# Altium project Elreg_Sender_2021.PrjPcb (part 1 of 2)
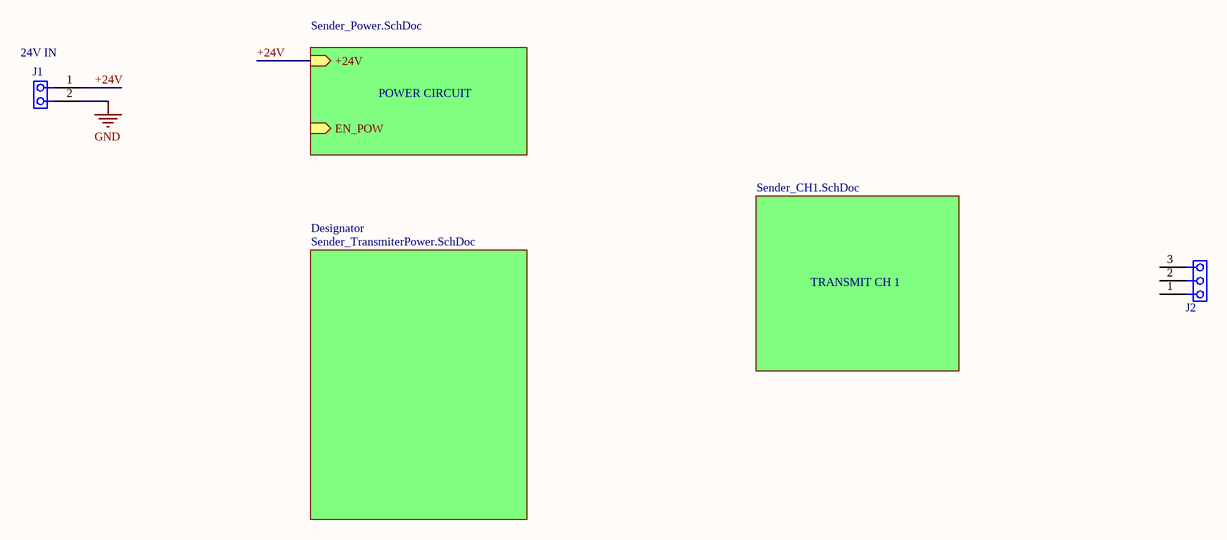
[diagram p0: Sender_Top.SchDoc]
4 sheets, 139 parts. Net scope: hierarchical (ports join the sheet entries above them; power ports are global).
Board file: Elreg_Sender_NoFPGA.PcbDoc
Sheets:
  Sender_Top.SchDoc
    POWER CIRCUIT = Sender_Power.SchDoc
    TRANSMIT CH 1 = Sender_CH1.SchDoc
    Designator = Sender_TransmiterPower.SchDoc

## Sheet Sender_Top.SchDoc
size A4

### Parts
J1  24V IN  [WAGO_2_pins]
J2  CONN 3x1  [WAGO-3_pins]  (value not drawn)

### Sub-sheets
Designator = Sender_TransmiterPower.SchDoc: no entries
POWER CIRCUIT = Sender_Power.SchDoc: +24V (in), EN_POW (in)
TRANSMIT CH 1 = Sender_CH1.SchDoc: no entries

### Nets
GND: J1.2(Vout)
+24V: J1.1(Vout) ; sheet POWER CIRCUIT/+24V

Not connected (* = marked no-connect by the designer): J2 1(Vout) 2(Vout) 3(Vout)

### Library data of the parts
J1 = 2x1 connector
J2 = 3x1 connector

## Sheet Sender_Power.SchDoc
size A4
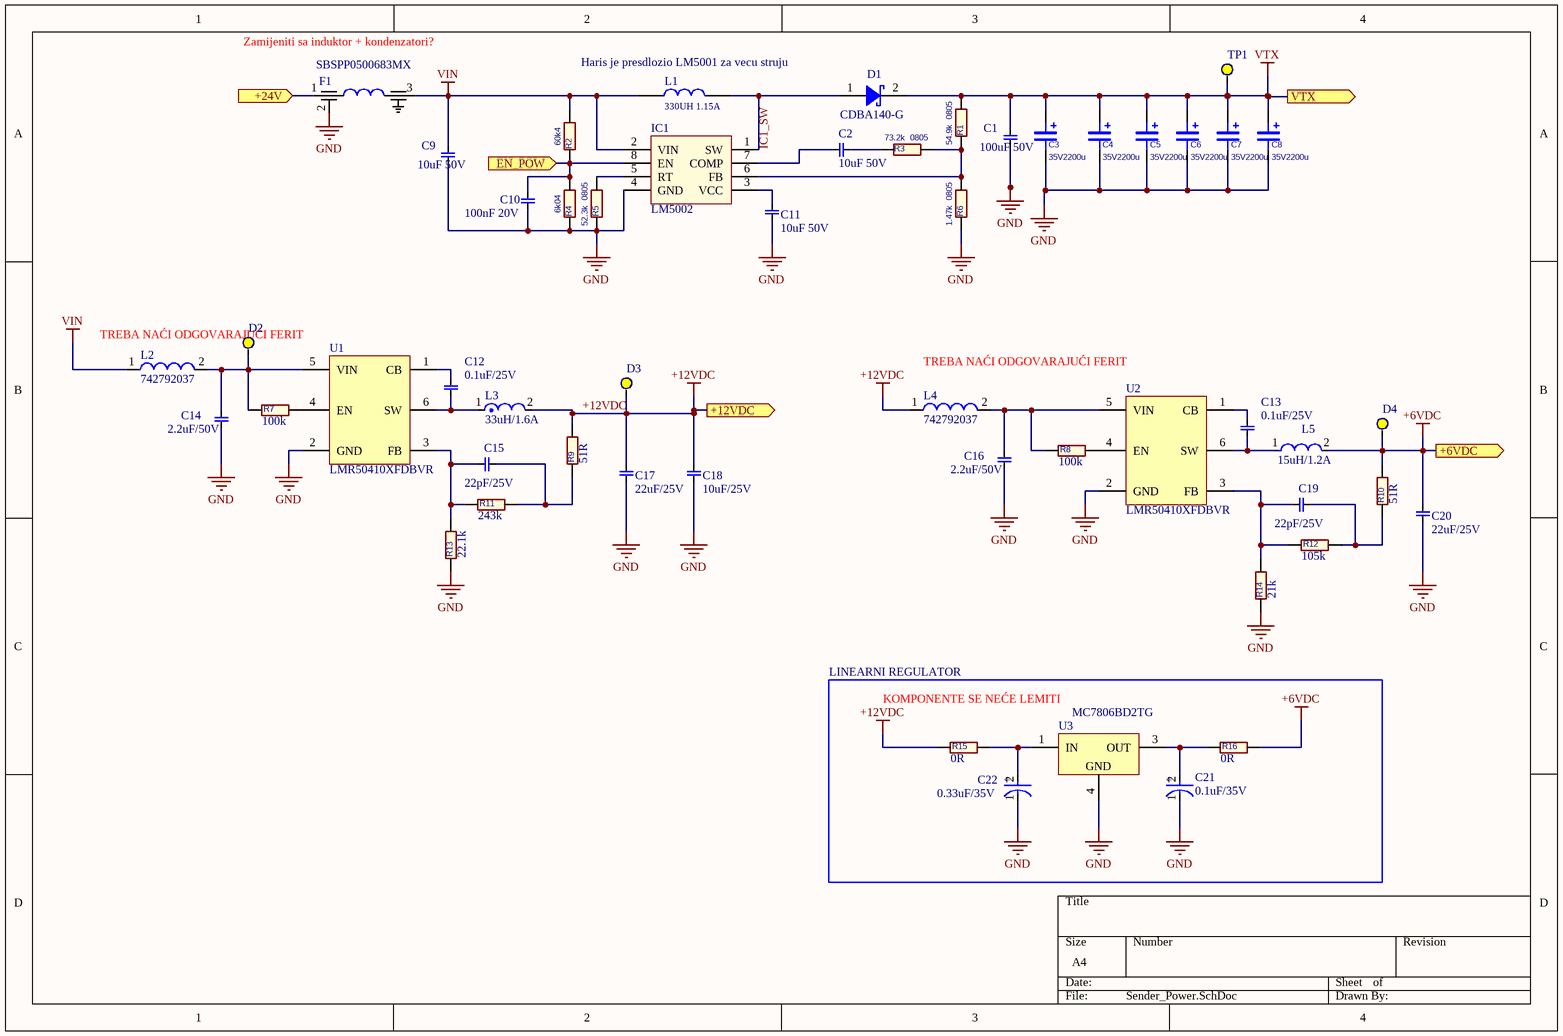
[diagram p1: Sender_Power.SchDoc]

### Parts
C1  100uF 50V  [C-0805]
C2  10uF 50V  [C-0603]
C3  35V2200u  [CAP_16X25]
C4  35V2200u  [CAP_16X25]
C5  35V2200u  [CAP_16X25]
C6  35V2200u  [CAP_16X25]
C7  35V2200u  [CAP_16X25]
C8  35V2200u  [CAP_16X25]
C9  10uF 50V  [C-0805]
C10  100nF 20V  [C-0603]
C11  10uF 50V  [C-0603]
C12  0.1uF/25V  [C-0603]
C13  0.1uF/25V  [C-0603]
C14  2.2uF/50V  [FP-CL31-IPC_B]
C15  22pF/25V  [C-0603]
C16  2.2uF/50V  [FP-CL31-IPC_B]
C17  22uF/25V  [CAP-1210]
C18  10uF/25V  [C-1206 (3216 metric)]
C19  22pF/25V  [C-0603]
C20  22uF/25V  [CAP-1210]
C21  0.1uF/35V  [FP-UUP1H0R1MCL1GS-MFG]
C22  0.33uF/35V  [FP-UUP1H0R1MCL1GS-MFG]
D1  Manufacturer Part Number 1: CDBA140-G  [DFN380P520X45-2N]  (hidden comment: DIODE SCHOTTKY 40V 1A DO214AC)
D2  Test_Point  [Test_Point]  (value not drawn)
D3  Test_Point  [Test_Point]  (value not drawn)
D4  Test_Point  [Test_Point]  (value not drawn)
F1  SBSPP0500683MX  [Filter_SBSPP0500]
IC1  LM5002  [SOIC127P600X205-8N]
L1  330UH 1.15A  [IND]
L2  742792037  [SMD-0805]
L3  33uH/1.6A  [FP-DS104C2-MFG]
L4  742792037  [SMD-0805]
L5  15uH/1.2A  [FP-LQH5BPB_T0-MFG]
R1  54.9k  0805  [R-0603]
R2  60k4  [R-0603]
R3  73.2k  0805  [R-0603]
R4  6k04  [R-0603]
R5  52.3k  0805  [R-0603]
R6  1.47k  0805  [R-0603]
R7  100k  [R-0603]
R8  100k  [R-0603]
R9  51R  [R-0603]
R10  51R  [R-0603]
R11  243k  [R-0603]
R12  105k  [R-0603]
R13  22.1k  [R-0603]
R14  21k  [R-0603]
R15  0R  [RES-0805]
R16  0R  [RES-0805]
TP1  Test_Point  [Test_Point]  (value not drawn)
U1  LMR50410XFDBVR  [SOT-23]
U2  LMR50410XFDBVR  [SOT-23]
U3  MC7806BD2TG  [D2PAK]

### Ports
+6VDC (out), +12VDC (out), +24V (in), EN_POW (in), VTX (out)

### Nets
+6VDC: C20.2(G) D4.1 L5.2 R10.2 R16.2 ; port +6VDC
+12VDC: C17.2(G) C18.1(G) D3.1 L3.2 L4.1 R9.2 R15.1 ; port +12VDC
GND: C1.2(G) C3.2 C4.2 C5.2 C6.2 C7.2 C8.2 C9.2(G) C10.1(G) C11.2(G) C14.1(G) C16.1(G) C17.1(G) C18.2(G) C20.1(G) C21.1(C) C22.1(C) F1.2 IC1.4(GND) R4.1 R5.1 R6.1 R13.1 R14.1 U1.2(GND) U2.2(GND) U3.4(GND)
VIN: C9.1(G) F1.3 IC1.2(VIN) L1.1(A) L2.1 R2.2
VTX: C1.1(G) C3.1 C4.1 C5.1 C6.1 C7.1 C8.1 D1.2(A) R1.2 TP1.1 ; port VTX
+24V: F1.1 ; port +24V
NetC2_1: C2.1(G) IC1.7(COMP)
NetC2_2: C2.2(G) R3.1
NetC10_2: C10.2(G) IC1.8(EN) R2.1 R4.2 ; port EN_POW
NetC11_1: C11.1(G) IC1.3(VCC)
NetC12_1: C12.1(G) L3.1 U1.6(SW)
NetC12_2: C12.2(G) U1.1(CB)
NetC13_1: C13.1(G) L5.1 U2.6(SW)
NetC13_2: C13.2(G) U2.1(CB)
NetC14_2: C14.2(G) D2.1 L2.2 R7.1 U1.5(VIN)
NetC15_1: C15.1(G) R11.1 R13.2 U1.3(FB)
NetC15_2: C15.2(G) R9.1 R11.2
NetC16_2: C16.2(G) L4.2 R8.1 U2.5(VIN)
NetC19_1: C19.1(G) R12.1 R14.2 U2.3(FB)
NetC19_2: C19.2(G) R10.1 R12.2
NetC21_2: C21.2(A) R16.1 U3.3(OUT)
NetC22_2: C22.2(A) R15.2 U3.1(IN)
NetD1_1: D1.1(A) IC1.1(SW) L1.2(A)
NetIC1_5: IC1.5(RT) R5.2
NetIC1_6: IC1.6(FB) R1.1 R3.2 R6.2
NetR7_2: R7.2 U1.4(EN)
NetR8_2: R8.2 U2.4(EN)

### Notes on the sheet
- (near F1) Zamijeniti sa induktor + kondenzatori?
- (near L1) Haris je presdlozio LM5001 za vecu struju
- (near D2) TREBA NAĆI ODGOVARAJUĆI FERIT
- TREBA NAĆI ODGOVARAJUĆI FERIT
- LINEARNI REGULATOR
- KOMPONENTE SE NEĆE LEMITI
- Labels drawn without touching a wire or pin: IC1_SW
- (in symbol UUP1H0R1MCL1GS) +
- (in symbol UZS1HR33MCL1GB) +

### Library data of the parts
C1 C2 C9 C11 = C-0805_10uF: Manufacturer 1: Yageo; Manufacturer Part Number 1: CC1206KKX7RBBB332; Tolerance: ±10%; Voltage - Rated: 500V; Temperature Coefficient: X7R; Notification: Current market demand for these product types have resulted in fluctuating and extending lead times. Lead times may differ.; Description 1: CAP CER 3300PF 500V X7R 1206; Category 1: Capacitors; Packaging: Cut Tape (CT); Part Status: Active; Operating Temperature: -55°C ~ 125°C; Features: -; Ratings: -; Applications: General Purpose; Failure Rate: -; Mounting Type: Surface Mount, MLCC; Package / Case: 1206 (3216 Metric); Size / Dimension: 0.126" L x 0.063" W (3.20mm x 1.60mm); Height - Seated (Max): -; Thickness (Max): 0.057" (1.45mm); Lead Spacing: -; Lead Style: -; ComponentLink1URL: http://www.yageo.com/documents/recent/UPY-NP0X7R_MV_100-to-630V_21.pdf; ComponentLink1Description: http://www.yageo.com/documents/recent/UPY-NP0X7R_MV_100-to-630V_21.pdf; Supplier 1: Digi-Key; Supplier Part Number 1: 311-1506-1-ND; RoHS 1: RoHS Compliant; Stock 1: 4928; Pricing 1: 1=0.31, 10=0.214, 100=0.1085, 500=0.07424, 1000=0.06568 (USD)
C3-C8 = CAP_2200uF_35V: Capacitor; Manufacturer: Kemet; Manufacturer Part Number: ESH228M035AM7AA; Capacitance: 2200µF; Tolerance: ±20%; Voltage Rating: 35V; Lifetime @ Temp.: 2000 Hrs @ 105°C; Supplier 1: Digi-Key; Supplier Part Number 1: 399-6572-ND; RoHS: RoHS Compliant; Category: Capacitors; Stock 1: 1972; Pricing 1: 1=0.98, 10=0.77, 50=0.6676, 100=0.5778, 250=0.5136, 500=0.43656, 1000=0.3852, 2500=0.35952, 5000=0.34668 (USD); Packaging: Bulk; ESR (Equivalent Series Resistance): -; Operating Temperature: -40°C ~ 105°C; Type: -; Applications: General Purpose; Ripple Current: -; Impedance: -; Lead Spacing: 0.295" (7.50mm); Size / Dimension: 0.630" Dia (16.00mm); Height - Seated (Max): 1.063" (27.00mm); Surface Mount Land Size: -; Mounting Type: Through Hole; Package / Case: Radial, Can; ComponentLink1URL: http://www.kemet.com/docfinder?Partnumber=ESH228M035AM7AA; ComponentLink1Description: http://www.kemet.com/docfinder?Partnumber=ESH228M035AM7AA
C10 = C-0805_100nF: Manufacturer 1: Yageo; Manufacturer Part Number 1: CC1206KKX7RBBB332; Tolerance: ±10%; Voltage - Rated: 500V; Temperature Coefficient: X7R; Notification: Current market demand for these product types have resulted in fluctuating and extending lead times. Lead times may differ.; Description 1: CAP CER 3300PF 500V X7R 1206; Category 1: Capacitors; Packaging: Cut Tape (CT); Part Status: Active; Operating Temperature: -55°C ~ 125°C; Features: -; Ratings: -; Applications: General Purpose; Failure Rate: -; Mounting Type: Surface Mount, MLCC; Package / Case: 1206 (3216 Metric); Size / Dimension: 0.126" L x 0.063" W (3.20mm x 1.60mm); Height - Seated (Max): -; Thickness (Max): 0.057" (1.45mm); Lead Spacing: -; Lead Style: -; ComponentLink1URL: http://www.yageo.com/documents/recent/UPY-NP0X7R_MV_100-to-630V_21.pdf; ComponentLink1Description: http://www.yageo.com/documents/recent/UPY-NP0X7R_MV_100-to-630V_21.pdf; Supplier 1: Digi-Key; Supplier Part Number 1: 311-1506-1-ND; RoHS 1: RoHS Compliant; Stock 1: 4928; Pricing 1: 1=0.31, 10=0.214, 100=0.1085, 500=0.07424, 1000=0.06568 (USD)
C12 C13 = 06033C104JAZ2A: 0.1µF ±5% 25V Ceramic Capacitor X7R 0603 (1608 Metric); Manufacturer: Kyocera AVX; Capacitance: 100nF; ComponentLink1URL: http://catalogs.avx.com/SurfaceMount.pdf?src-supplier=Digi-Key; ComponentLink1Description: http://catalogs.avx.com/SurfaceMount.pdf?src-supplier=Digi-Key; Case/Package: 0603; Category: Ceramic Capacitors; Dielectric: X7R; Features: Soft Termination; Length: 0.063inch; Manufacturer Part Number: 06033C104JAZ2A; Max Operating Temperature: 125°C; Min Operating Temperature: -55°C; Mount: Surface Mount; Package Quantity: 4000; Packaging: Tape and Reel; RoHS Compliant: Yes; Thickness: 0.035inch; Tolerance: 5%; Voltage Rating: 25V; Voltage Rating (DC): 25V; Width: 0.031inch
C14 C16 = CL31B225KBHVPNE: Cap Ceramic 2.2uF 50V X7R ±10% SMD 1206 +125°C Embossed T/R; Width: 0.063inch; Case/Package: 1206; Tolerance: 10%; Mount: Surface Mount; Capacitance: 2.2uF; Ratings: AEC-Q200; Thickness: 0.071inch; Voltage Rating: 50V; Features: Soft Termination; Case Code (Metric): 3216; Length: 0.126inch; Packaging: Tape and Reel; Max Operating Temperature: 125°C; Min Operating Temperature: -55°C; Case Code (Imperial): 1206; Dielectric: X7R
C15 C19 = C0603C220K3GACTU: 22pF ±10% 25V Ceramic Capacitor C0G, NP0 0603 (1608 Metric); Manufacturer: KEMET; Dissipation Factor: 0.1%; Width: 0.031inch; Capacitance: 22pF; Case Code (Imperial): 0603; Case Code (Metric): 1608; Case/Package: 0603; Category: Ceramic Capacitors; Construction: Flat; Contact Plating: Tin,Matte; Depth: 0.8mm; Dielectric: C0G; Dielectric Material: Ceramic; Height: 0.8mm; Lead Free: Lead Free; Lead Pitch: 0.7mm; Length: 1.6mm; Manufacturer Part Number: C0603C220K3GACTU; Max Operating Temperature: 125°C; Min Operating Temperature: -55°C; Mount: Surface Mount; Package Quantity: 4000; Packaging: Tape and Reel; Radiation Hardening: No; RoHS Compliant: Yes; Series: C; Termination: SMD/SMT; Thickness: 0.034inch; Tolerance: 10%; Voltage Rating: 25V; Voltage Rating (DC): 25V; ComponentLink1URL: https://datasheet.ciiva.com/5413/kem-c1003-c0g-smd-356956-5413159.pdf?src-supplier=Mouser; ComponentLink1Description: https://datasheet.ciiva.com/5413/kem-c1003-c0g-smd-356956-5413159.pdf?src-supplier=Mouser
C17 C20 = CL32B226KAJNNNE: 22µF ±10% 25V Ceramic Capacitor X7R 1210 (3225 Metric); Manufacturer: Samsung; Capacitance: 22uF; Case Code (Imperial): 1210; Case Code (Metric): 3225; Case/Package: 1210; Category: Ceramic Capacitors; Construction: Flat; Depth: 2.5mm; Dielectric: X7R; Height: 2.5mm; Lead Free: Lead Free; Length: 3.2mm; Manufacturer Part Number: CL32B226KAJNNNE; Material: Ceramic; Max Operating Temperature: 125°C; Min Operating Temperature: -55°C; Mount: Surface Mount; Package Quantity: 1; Packaging: Tape and Reel; Radiation Hardening: No; RoHS Compliant: Yes; Series: CL; Thickness: 0.106inch; Tolerance: 10%; Voltage Rating: 25V; Voltage Rating (DC): 25V; Width: 0.098inch
C18 = CL31B106KAHNNNE: 10µF ±10% 25V Ceramic Capacitor X7R 1206 (3216 Metric); Manufacturer: Samsung; Capacitance: 10uF; Case Code (Imperial): 1206; Case Code (Metric): 3216; Case/Package: 1206; Category: Ceramic Capacitors; Construction: Flat; Depth: 1.6mm; Dielectric: X7R; Height: 1.6mm; Length: 3.2mm; Manufacturer Part Number: CL31B106KAHNNNE; Max Operating Temperature: 125°C; Min Operating Temperature: -55°C; Mount: Surface Mount; Package Quantity: 1; Packaging: Tape and Reel; Radiation Hardening: No; RoHS Compliant: Yes; Series: CL; Thickness: 0.071inch; Tolerance: 10%; Voltage: 25V; Voltage Rating: 25V; Width: 0.063inch; ComponentLink1URL: https://datasheet.ciiva.com/25795/cl31b106kahnnne-25795260.pdf?src-supplier=Digi-Key; ComponentLink1Description: https://datasheet.ciiva.com/25795/cl31b106kahnnne-25795260.pdf?src-supplier=Digi-Key
C21 = UUP1H0R1MCL1GS: 0.1µF 50V Aluminum Electrolytic Capacitors Radial, Can - SMD  1000 Hrs @ 105°C; Life (Hours): 1000Hour; Leakage Current: 10uA; Ripple Current: 1mA; Tolerance: 20%; Dissipation Factor: 0.15%; Capacitance: 100nF; Radiation Hardening: No; Max Operating Temperature: 105°C; Voltage Rating: 50V; Package Quantity: 2000; Diameter: 4mm; Voltage Rating (DC): 50V; Mount: Surface Mount; Packaging: Tape and Reel; Termination: SMD/SMT; Min Operating Temperature: 1000°C; Length: 5.8mm; Height: 5.8mm; Case/Package: Radial; Height - Seated (Max): 0.157inch
C22 = UZS1HR33MCL1GB: 0.33µF 50V Aluminum Electrolytic Capacitors Radial, Can - SMD  2000 Hrs @ 85°C; Manufacturer: Nichicon; Capacitance: 330nF; Leakage Current: 3uA; Life (Hours): 2000Hour; Ripple Current: 2.8mA; Tolerance: 20%; Voltage Rating (DC): 50V; Case/Package: Radial; Category: Aluminum Electrolytic Capacitors; Features: General Purpose; Height - Seated (Max): 0.157inch; Length: 4.5mm; Manufacturer Part Number: UZS1HR33MCL1GB; Max Operating Temperature: 85°C; Min Operating Temperature: -40°C; Mount: Surface Mount; Package Quantity: 2000; Packaging: Tape and Reel; RoHS Compliant: Yes; Series: ZS; Termination: SMD/SMT; Voltage Rating: 50V
D1 = DIODE SCHOTTKY 40V 1A DO214AC: Manufacturer 1: Comchip Technology; Category 1: Discrete Semiconductor Products; Speed: Fast Recovery =< 500ns, > 200mA (Io); Supplier 1: Digi-Key; Supplier Part Number 1: 641-1015-1-ND; RoHS 1: RoHS Compliant; Description 1: DIODE SCHOTTKY 40V 1A DO214AC; Stock 1: 527910; Pricing 1: 1=0.37, 10=0.338, 100=0.1893, 500=0.1014, 1000=0.06895 (USD); Packaging: Cut Tape (CT); Part Status: Active; Diode Type: Schottky; Current - Average Rectified (Io): 1A; Capacitance @ Vr, F: -; Mounting Type: Surface Mount; Package / Case: DO-214AC, SMA; Supplier Device Package: DO-214AC (SMA); Operating Temperature - Junction: -65°C ~ 125°C; Base Part Number: CDBA140; ComponentLink1URL: http://www.comchiptech.com/admin/files/product/CDBA140-HF%20Thru192841.%20CDBA1100-HF%20RevB.pdf; ComponentLink1Description: http://www.comchiptech.com/admin/files/product/CDBA140-HF%20Thru192841.%20CDBA1100-HF%20RevB.pdf
F1 = Filter_SBSPP0500683MX
IC1 = LM5002: Manufacturer 1: Texas Instruments; Manufacturer Part Number 1: LM5002SD/NOPB; Description 1: IC REG MULT CONFIG ISO ADJ 8WSON; Category 1: Integrated Circuits (ICs); Function: Step-Up, Step-Up/Step-Down; Output Configuration: Positive, Isolation Capable; Topology: Boost, Flyback, Forward Converter, SEPIC; Output Type: Adjustable; Number of Outputs: 1; Voltage - Input (Min): 3.1V; Voltage - Input (Max): 75V; Voltage - Output (Max): 76V (Switch); Current - Output: 400mA (Switch); Frequency - Switching: 50kHz ~ 1.5MHz; Synchronous Rectifier: No; Supplier 1: Digi-Key; Supplier Part Number 1: LM5002SD/NOPBTR-ND; RoHS 1: RoHS Compliant; Stock 1: 3000; Pricing 1: 1000=1.9656, 2000=1.86732, 5000=1.79712 (USD); Packaging: Tape & Reel (TR); Part Status: Active; Voltage - Output (Min/Fixed): 3.1V; Operating Temperature: -40°C ~ 125°C (TJ); Mounting Type: Surface Mount; Package / Case: 8-WDFN Exposed Pad; Supplier Device Package: 8-WSON (4x4); ComponentLink1URL: http://www.ti.com/lit/ds/symlink/lm5002.pdf; ComponentLink1Description: http://www.ti.com/lit/ds/symlink/lm5002.pdf; Base Part Number: LM5002
L1 = FIXED IND 330UH 1.15A 580 MOHM: Manufacturer 1: BOURNS; Manufacturer Part Number 1: SRR1260-331K; Description 1: BOURNS - SRR1260-331K - INDUCTOR, SHIELDED, 330UH, 1.1A, SMD; Inductance: 330; RMS Current (Irms): 1.15; Inductor Construction: Shielded; Saturation Current (Isat): 1.1; Product Range: SRR1260 Series; Power Inductor Case: 12.5mm x 12.5mm x 6; Q Factor: 22; Supplier 1: Farnell; Supplier Part Number 1: 2458509; RoHS 1: YES; Stock 1: 143; Pricing 1: 1=0.843, 10=0.721, 25=0.661, 50=0.6, 100=0.552 (GBP); ComponentLink1URL: http://www.farnell.com/datasheets/2251090.pdf; ComponentLink1Description: http://www.farnell.com/datasheets/2251090.pdf
L2 L4 = 742792037: SMD EMI Suppression Ferrite Bead WE-CBF, Z = 330 Ohm; Impedance: 330 Ohm; PackageReference: SMD-0805; ComponentLink1URL: http://www.we-online.com; PackageVersion: 2005; ComponentLink2URL: http://www.we-online.de/katalog/media/pdf/742792037.pdf; ComponentLink1Description: Manufacturer Link; DatasheetVersion: Dec-2005; PackageDescription: Chip Inductor, 2-Leads, Body 2.0 x 1.2 mm; ComponentLink2Description: Datasheet
L3 = #B952AS-H-330M=P3: Shielded Wirewound Inductor 33uH 20% 1600mA 0.125Ω SMD; Current Rating: 1.6A; Saturation Current: 2A; DC Resistance (DCR): 125mR; Core Material: Ferrite; Test Frequency: 100kHz; Shielding: Shielded; Tolerance: 20%; Height - Seated (Max): 0.19inch; Mount: Surface Mount; Resistor Type: Wirewound; Inductance: 33uH; Packaging: Tape and Reel; Min Operating Temperature: -40°C; Length: 0.409inch; Width: 0.409inch; Case/Package: Nonstandard; Max Operating Temperature: 85°C
L5 = LQH5BPN150MT0L: 15µH Shielded Wirewound Inductor 1.2A 187mOhm Max Nonstandard; Core Material: Ferrite; Inductance: 15uH; Saturation Current: 1.6A; Test Frequency: 100kHz; Self Resonant Frequency: 18MHz; Tolerance: 20%; DC Resistance (DCR): 225mR; Max Operating Temperature: 85°C; Length: 0.197inch; Depth: 5.2mm; REACH SVHC: No SVHC; Package Quantity: 500; Packaging: Tape and Reel; Resistor Type: Wirewound; Inductance Tolerance: 20%; Military Standard: Not; DC Current: 1.2A; Min Operating Temperature: -40°C; Current Rating: 1.2A; Case Code (Metric): 5050; Height - Seated (Max): 0.086inch; Case/Package: 2020; Termination: SMD/SMT; Case Code (Imperial): 2020; Shielding: Shielded; Height: 2mm; Width: 5mm; Max DC Current: 1.6A; Mount: Surface Mount
R1 R3 R5 R6 = CRCW0805xxxxJN Default: RES xx OHM 1/8W 5% 0805 SMD; Category 1: Resistors
R2 R4 = CRCW08051K00FKEA: RES 1 KOHM 1/8W 1% 0805 SMD; Manufacturer 1: Vishay Dale; Description 1: RES SMD 1K OHM 1% 1/8W 0805; Category 1: Resistors; Resistance (Ohms): 1k; Power (Watts): 0.125W, 1/8W; Temperature Coefficient: ±100ppm/°C; Description 2: Thick Film Resistors - SMD 1/8watt 1Kohms 1% 100ppm; Category 2: Thick Film Resistors - SMD; Power Rating: 125 mW (1/8 W); Resistance: 1 kOhms; Voltage Rating: 150 V; Brand: Vishay / Dale; Supplier 1: Digi-Key; Supplier Part Number 1: 541-1.00KCCT-ND; Manufacturer Part Number 1: CRCW08051K00FKEA; RoHS 1: RoHS Compliant; Packaging: Cut Tape (CT); Tolerance: ±1%; Composition: Thick Film; Features: Automotive AEC-Q200; Operating Temperature: -55°C ~ 155°C; Package / Case: 0805 (2012 Metric); Supplier Device Package: 0805 (2012 Metric); Size / Dimension: 0.079" L x 0.049" W (2.00mm x 1.25mm); Height: 0.020" (0.50mm); ComponentLink1URL: http://www.vishay.com/docs/20035/dcrcwe3.pdf; ComponentLink1Description: http://www.vishay.com/docs/20035/dcrcwe3.pdf; Supplier 2: Mouser; Supplier Part Number 2: 71-CRCW0805-1.0K-E3; Manufacturer 2: Vishay; Manufacturer Part Number 2: CRCW08051K00FKEA; RoHS 2: RoHS Compliant By Exemption; Length: 2 mm; Operating Temperature Range: - 55 C to + 155 C; Package/Case: 0805 (2012 metric); Product: Thick Film Resistors SMD; Series: CRCW; Termination Style: SMD/SMT; Width: 1.25 mm; Case Code - in: 0805; Case Code - mm: 2012; Product Category: 0805 Thick Film Chip Resistors; Standard Pack Qty: 5000; RoHS - Mouser: E; Minimum Order Quantity: 1; Reeling: True; ComponentLink2URL: http://www.mouser.com/ds/2/427/dcrcwe3-109170.pdf; ComponentLink2Description: http://www.mouser.com/ds/2/427/dcrcwe3-109170.pdf
R7 R8 = RR0816P-104-D: 100 kOhms ±0.5% 0.063W, 1/16W Chip Resistor 0603 (1608 Metric)  Thin Film; Manufacturer: Susumu; Working Voltage: 75V; Max Power Dissipation: 63mW; Resistance: 100kR; Temperature Coefficient: 25ppm/°C; ComponentLink1URL: https://datasheet.ciiva.com/2487/rr-data-sheet-2487067.pdf?src-supplier=Digi-Key; ComponentLink1Description: https://datasheet.ciiva.com/2487/rr-data-sheet-2487067.pdf?src-supplier=Digi-Key; Case Code (Imperial): 0603; Case Code (Metric): 1608; Case/Package: 0603; Category: Chip SMD Resistors; Depth: 0.8mm; Height: 0.4mm; Lead Free: Lead Free; Length: 1.6mm; Manufacturer Part Number: RR0816P-104-D; Max Operating Temperature: 125°C; Min Operating Temperature: -55°C; Number of Pins: 2; Number of Terminations: 2; Package Quantity: 1; Packaging: Tape and Reel; Power Rating: 63mW; REACH SVHC: Unknown; Resistance Tolerance: 0.5%; Resistor Type: Thin Film; RoHS Compliant: Yes; Series: RR; Technology: THIN FILM; Termination: SMD/SMT; Tolerance: 0.5%; Voltage Rating: 75V; Voltage Rating (DC): 75V; Width: 0.8mm
R9 R10 = RR0816Q-510-D: 51 Ohms ±0.5% 0.063W, 1/16W Chip Resistor 0603 (1608 Metric)  Thin Film; Manufacturer: Susumu; Max Power Dissipation: 63mW; Power Rating: 62.5mW; Temperature Coefficient: 50ppm/°C; Voltage Rating: 75V; ComponentLink1URL: https://datasheet.ciiva.com/2498/rr-data-sheet-2498074.pdf?src-supplier=Digi-Key; ComponentLink1Description: https://datasheet.ciiva.com/2498/rr-data-sheet-2498074.pdf?src-supplier=Digi-Key; Width: 0.8mm; Case Code (Imperial): 0603; Case Code (Metric): 1608; Case/Package: 0603; Category: Chip SMD Resistors; Depth: 0.8mm; Height: 0.4mm; Lead Free: Lead Free; Length: 1.6mm; Manufacturer Part Number: RR0816Q-510-D; Max Operating Temperature: 125°C; Min Operating Temperature: -55°C; Mount: Surface Mount; Number of Terminations: 2; Package Quantity: 1; Packaging: Tape and Reel; Resistance: 51R; Resistor Type: Thin Film; RoHS Compliant: Yes; Series: RR; Size Code: 0603; Technology: THIN FILM; Termination: SMD/SMT; Tolerance: 0.5%; Voltage Rating (DC): 75V; ComponentLink2URL: https://datasheet.ciiva.com/2498/rr-data-sheet-2498317.pdf?src-supplier=Digi-Key; ComponentLink2Description: https://datasheet.ciiva.com/2498/rr-data-sheet-2498317.pdf?src-supplier=Digi-Key
R11 = RR0816P-2433-D-38D: 243 kOhms ±0.5% 0.063W, 1/16W Chip Resistor 0603 (1608 Metric)  Thin Film; Manufacturer: Susumu; Max Power Dissipation: 63mW; Power Rating: 62.5mW; Resistance: 243kR; Temperature Coefficient: 25ppm/°C; Voltage Rating: 75V; Width: 0.8mm; Case Code (Imperial): 0603; Case Code (Metric): 1608; Case/Package: 0603; Category: Chip SMD Resistors; Height: 0.02inch; Lead Free: Lead Free; Length: 0.063inch; Manufacturer Part Number: RR0816P-2433-D-38D; Max Operating Temperature: 125°C; Min Operating Temperature: -55°C; Number of Terminations: 2; Package Quantity: 1; Packaging: Tape and Reel; Resistor Type: Thin Film; RoHS Compliant: Yes; Series: RR; Termination: SMD/SMT; Tolerance: 0.5%; Voltage Rating (DC): 75V; Weight: 7.1E-05oz; ComponentLink1URL: https://datasheet.ciiva.com/2498/rr-data-sheet-2498074.pdf?src-supplier=Digi-Key; ComponentLink1Description: https://datasheet.ciiva.com/2498/rr-data-sheet-2498074.pdf?src-supplier=Digi-Key
R12 = RN73C1J105KBTD: 105 kOhms ±0.1% 0.063W, 1/16W Chip Resistor 0603 (1608 Metric)  Thin Film; Manufacturer: TE Connectivity; Manufacturer Part Number: RN73C1J105KBTDF; Max Power Dissipation: 63mW; Number of Resistors: 1; Resistance: 105kR; Temperature Coefficient: 10ppm/°C; Voltage Rating: 50V; Case Code (Imperial): 0603; Case Code (Metric): 1608; Case/Package: 0603; Category: Chip SMD Resistors; ELV: Compliant; Height: 0.45mm; Length: 1.55mm; Max Operating Temperature: 155°C; Min Operating Temperature: -55°C; Mount: Surface Mount; Number of Terminations: 2; Package Quantity: 1000; Packaging: Tape and Reel; Power Rating: 63mW; Resistance Tolerance: 0.1%; Resistor Type: Thin Film; RoHS Compliant: Yes; Series: RN73, Holsworthy; Termination: Solder; Tolerance: 0.1%; Voltage Rating (DC): 50V; Width: 0.8mm; ComponentLink1URL: https://www.te.com/commerce/DocumentDelivery/DDEController?Action=srchrtrv&amp;DocNm=1773270&amp;DocType=DS&amp;DocLang=English&src-supplier=Digi-Key; ComponentLink1Description: https://www.te.com/commerce/DocumentDelivery/DDEController?Action=srchrtrv&amp;DocNm=1773270&amp;DocType=DS&amp;DocLang=English&src-supplier=Digi-Key
R13 = RR0816P-2212-D-34C: 22.1 kOhms ±0.5% 0.063W, 1/16W Chip Resistor 0603 (1608 Metric)  Thin Film; Manufacturer: Susumu; Max Power Dissipation: 63mW; Power Rating: 62.5mW; Resistance: 22.1kR; Temperature Coefficient: 25ppm/°C; Voltage Rating: 75V; Case Code (Imperial): 0603; Case Code (Metric): 1608; Case/Package: 0603; Category: Chip SMD Resistors; Height: 0.02inch; Height - Seated (Max): 0.02inch; Lead Free: Lead Free; Length: 0.063inch; Manufacturer Part Number: RR0816P-2212-D-34C; Max Operating Temperature: 125°C; Min Operating Temperature: -55°C; Number of Terminations: 2; Package Quantity: 1; Packaging: Tape and Reel; Resistor Type: Thin Film; RoHS Compliant: Yes; Series: RR; Size Code: 0603; Termination: SMD/SMT; Tolerance: 0.5%; Voltage Rating (DC): 75V; Width: 0.032inch; ComponentLink1URL: https://datasheet.ciiva.com/2497/rr-data-sheet-2497842.pdf?src-supplier=Digi-Key; ComponentLink1Description: https://datasheet.ciiva.com/2497/rr-data-sheet-2497842.pdf?src-supplier=Digi-Key
R14 = RR0816P-2102-D-32C: 21 kOhms ±0.5% 0.063W, 1/16W Chip Resistor 0603 (1608 Metric)  Thin Film; Manufacturer: Susumu; Max Power Dissipation: 63mW; Power Rating: 62.5mW; Resistance: 21kR; Temperature Coefficient: 25ppm/°C; Voltage Rating: 75V; Case Code (Imperial): 0603; Case Code (Metric): 1608; Case/Package: 0603; Category: Chip SMD Resistors; Height: 0.02inch; Lead Free: Lead Free; Length: 0.063inch; Manufacturer Part Number: RR0816P-2102-D-32C; Max Operating Temperature: 125°C; Min Operating Temperature: -55°C; Number of Terminations: 2; Package Quantity: 1; Packaging: Tape and Reel; Resistor Type: Thin Film; RoHS Compliant: Yes; Series: RR; Size Code: 0603; Termination: SMD/SMT; Tolerance: 0.5%; Voltage Rating (DC): 75V; Width: 0.8mm; ComponentLink1URL: https://datasheet.ciiva.com/2487/rr-data-sheet-2487553.pdf?src-supplier=Digi-Key; ComponentLink1Description: https://datasheet.ciiva.com/2487/rr-data-sheet-2487553.pdf?src-supplier=Digi-Key
R15 R16 = RC0805JR-070RL: 0 Ohms Jumper 0.125W, 1/8W Chip Resistor 0805 (2012 Metric) Moisture Resistant Thick Film
U1 U2 = LMR50410XFDBVR: Buck Switching Regulator IC Positive Adjustable 1V 1 Output 1A SOT-23-6; Manufacturer: Texas Instruments; Manufacturer Part Number: LMR50410XFDBVR
U3 = MC7806BD2TG: IC REG LINEAR 6V 1A D2PAK; Manufacturer: ON Semiconductor; Accuracy: 4%; Dropout Voltage: 2V; Max Input Voltage: 35V; Number of Outputs: 1; Output Type: Fixed; Polarity: Positive; Quiescent Current: 8mA; Case/Package: D2PAK; Category: Voltage Regulators - Linear; Contact Plating: Tin,Matte; Halogen Free: Halogen Free; Height: 4.572mm; Lead Free: Lead Free; Length: 10.24mm; Manufacturer Part Number: MC7806BD2TG; Max Operating Temperature: 125°C; Max Output Current: 1A; Min Input Voltage: 35V; Min Operating Temperature: -40°C; Min Output Voltage: 6V; Mount: Surface Mount; Number of Pins: 3; Number of Regulators: 1; Output Current: 1A; Output Voltage: 6V; Output Voltage Accuracy: 4%; Package Quantity: 50; Packaging: Rail/Tube; Radiation Hardening: No; RoHS Compliant: Yes; Series: -; Width: 9.347mm; ComponentLink1URL: https://datasheet.ciiva.com/6581/mc7800-d-6581174.pdf?src-supplier=Digi-Key; ComponentLink1Description: https://datasheet.ciiva.com/6581/mc7800-d-6581174.pdf?src-supplier=Digi-Key

## Sheet Sender_CH1.SchDoc
size A4
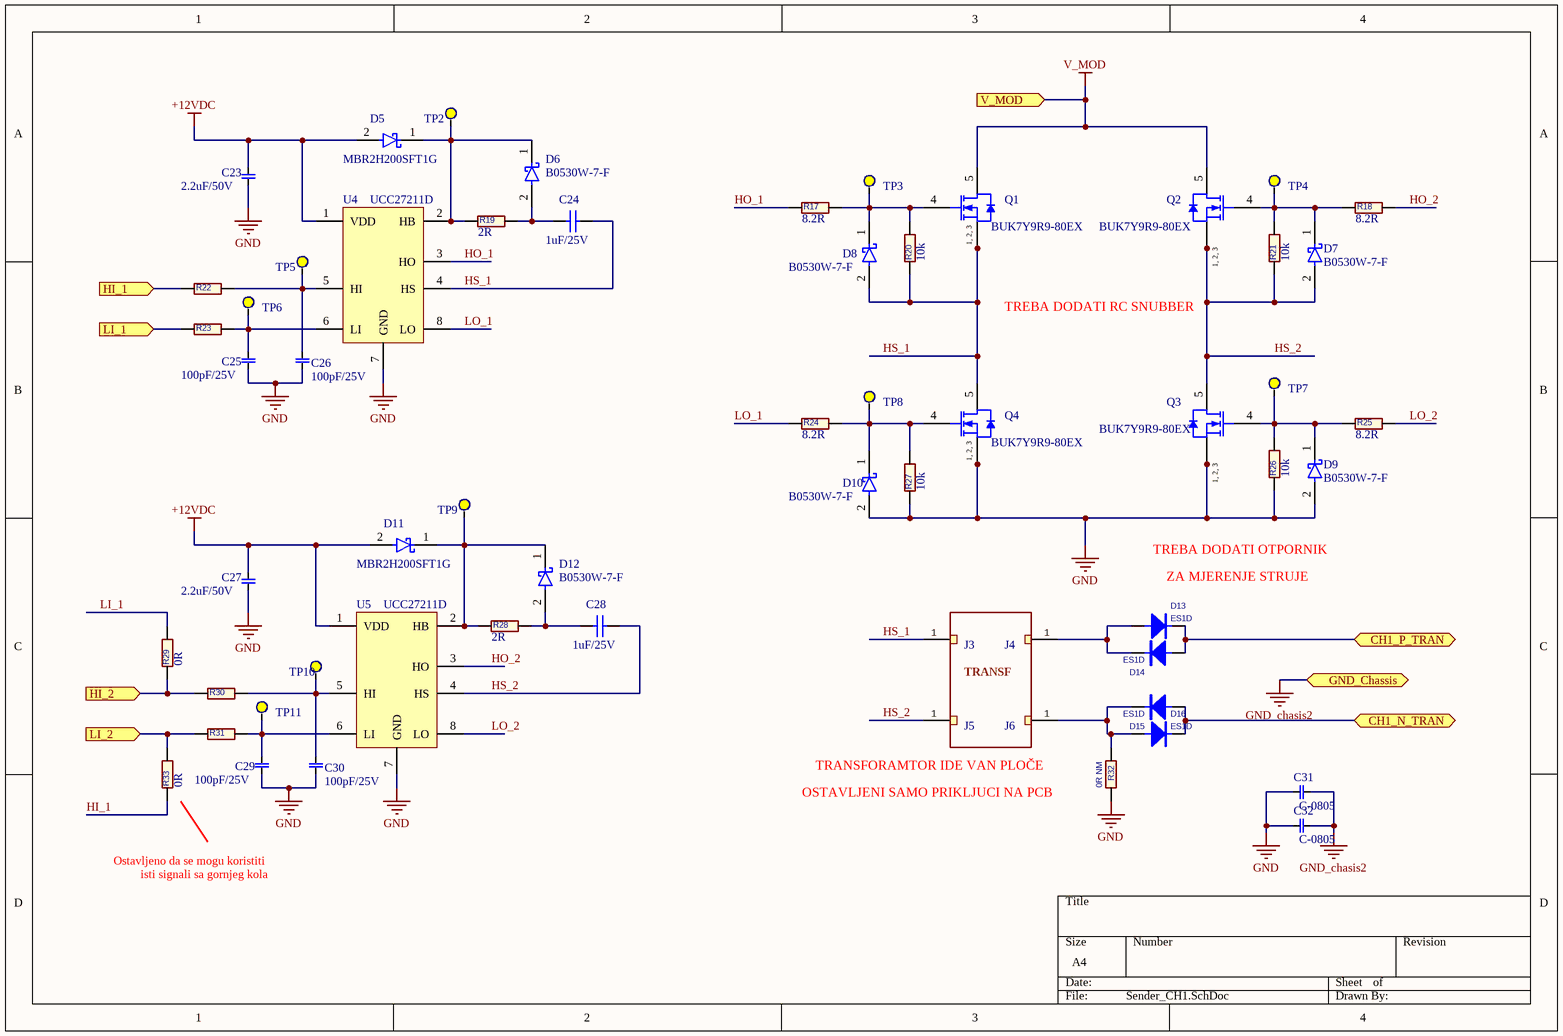
[diagram p2: Sender_CH1.SchDoc]

### Parts
C23  2.2uF/50V  [FP-CL31-IPC_B]
C24  1uF/25V  [CAPC2013X70X45LL10T25]
C25  100pF/25V  [C-0603]
C26  100pF/25V  [C-0603]
C27  2.2uF/50V  [FP-CL31-IPC_B]
C28  1uF/25V  [CAPC2013X70X45LL10T25]
C29  100pF/25V  [C-0603]
C30  100pF/25V  [C-0603]
C31  C-0805  [C-0805]
C32  C-0805  [C-0805]
D5  MBR2H200SFT1G  [FP-498-MFG]
D6  B0530W-7-F  [FP-SOD123-IPC_B]
D7  B0530W-7-F  [FP-SOD123-IPC_B]
D8  B0530W-7-F  [FP-SOD123-IPC_B]
D9  B0530W-7-F  [FP-SOD123-IPC_B]
D10  B0530W-7-F  [FP-SOD123-IPC_B]
D11  MBR2H200SFT1G  [FP-498-MFG]
D12  B0530W-7-F  [FP-SOD123-IPC_B]
D13  ES1D  [SMA]
D14  ES1D  [SMA]
D15  ES1D  [SMA]
D16  ES1D  [SMA]
J3  CON1_b  [CONN1 _b]  (value not drawn)
J4  CON1_b  [CONN1 _b]  (value not drawn)
J5  CON1_b  [CONN1 _b]  (value not drawn)
J6  CON1_b  [CONN1 _b]  (value not drawn)
Q1  BUK7Y9R9-80EX  [NXP-SOT669_N]
Q2  BUK7Y9R9-80EX  [NXP-SOT669_N]
Q3  BUK7Y9R9-80EX  [NXP-SOT669_N]
Q4  BUK7Y9R9-80EX  [NXP-SOT669_N]
R17  8.2R  [RES-0805]
R18  8.2R  [RES-0805]
R19  2R  [RESC3216X60X45NL10T20]
R20  10k  [R-0603]
R21  10k  [R-0603]
R22  1k  [R-0603]  (value not drawn)
R23  1k  [R-0603]  (value not drawn)
R24  8.2R  [RES-0805]
R25  8.2R  [RES-0805]
R26  10k  [R-0603]
R27  10k  [R-0603]
R28  2R  [RESC3216X60X45NL10T20]
R29  0R  [RES-0805]
R30  1k  [R-0603]  (value not drawn)
R31  1k  [R-0603]  (value not drawn)
R32  0R NM  [RES-0805]
R33  0R  [RES-0805]
TP2  Test_Point  [Test_Point]  (value not drawn)
TP3  Test_Point  [Test_Point]  (value not drawn)
TP4  Test_Point  [Test_Point]  (value not drawn)
TP5  Test_Point  [Test_Point]  (value not drawn)
TP6  Test_Point  [Test_Point]  (value not drawn)
TP7  Test_Point  [Test_Point]  (value not drawn)
TP8  Test_Point  [Test_Point]  (value not drawn)
TP9  Test_Point  [Test_Point]  (value not drawn)
TP10  Test_Point  [Test_Point]  (value not drawn)
TP11  Test_Point  [Test_Point]  (value not drawn)
U4  UCC27211D  [D-8 PIN 1.27pitch]
U5  UCC27211D  [D-8 PIN 1.27pitch]

### Blocks framed on the sheet
TRANSF: J3 J5

### Ports
CH1_N_TRAN (bidir), CH1_P_TRAN (bidir), GND_Chassis (bidir), HI_1 (in), HI_2 (in), LI_1 (in), LI_2 (in), V_MOD (in)

### Nets
+12VDC: C23.2(G) C27.2(G) D5.2(A) D11.2(A) U4.1(VDD) U5.1(VDD)
GND: C23.1(G) C25.1(G) C26.1(G) C27.1(G) C29.1(G) C30.1(G) C31.1(G) C32.1(G) D9.2(A) D10.2(A) Q3.1(S) Q3.2(S) Q3.3(S) Q4.1(S) Q4.2(S) Q4.3(S) R26.1 R27.1 R32.1 U4.7(GND) U5.7(GND)
GND_chasis2: C31.2(G) C32.2(G) ; port GND_Chassis
V_MOD: Q1.5(D) Q2.5(D) ; port V_MOD
HI_1: R33.1
HO_1: R17.1 U4.3(HO)
HO_2: R18.2 U5.3(HO)
HS_1: C24.2 D8.2(A) J3.1 Q1.1(S) Q1.2(S) Q1.3(S) Q4.5(D) R20.1 U4.4(HS)
HS_2: C28.2 D7.2(A) J5.1 Q2.1(S) Q2.2(S) Q2.3(S) Q3.5(D) R21.1 U5.4(HS)
LI_1: R29.2
LO_1: R24.1 U4.8(LO)
LO_2: R25.2 U5.8(LO)
NetC24_1: C24.1 D6.2(A) R19.2
NetC25_2: C25.2(G) R23.2 TP6.1 U4.6(LI)
NetC26_2: C26.2(G) R22.2 TP5.1 U4.5(HI)
NetC28_1: C28.1 D12.2(A) R28.2
NetC29_2: C29.2(G) R31.2 TP11.1 U5.6(LI)
NetC30_2: C30.2(G) R30.2 TP10.1 U5.5(HI)
NetD5_1: D5.1(C) D6.1(C) R19.1 TP2.1 U4.2(HB)
NetD7_1: D7.1(C) Q2.4(G) R18.1 R21.2 TP4.1
NetD8_1: D8.1(C) Q1.4(G) R17.2 R20.2 TP3.1
NetD9_1: D9.1(C) Q3.4(G) R25.1 R26.2 TP7.1
NetD10_1: D10.1(C) Q4.4(G) R24.2 R27.2 TP8.1
NetD11_1: D11.1(C) D12.1(C) R28.1 TP9.1 U5.2(HB)
NetD13_1: D13.1(A) D14.2(C) J4.1
NetD13_2: D13.2(C) D14.1(A) ; port CH1_P_TRAN
NetD15_1: D15.1(A) D16.2(C) ; port CH1_N_TRAN
NetD15_2: D15.2(C) D16.1(A) J6.1 R32.2
NetR22_1: R22.1 ; port HI_1
NetR23_1: R23.1 ; port LI_1
NetR29_1: R29.1 R30.1 ; port HI_2
NetR31_1: R31.1 R33.2 ; port LI_2

### Notes on the sheet
- TREBA DODATI RC SNUBBER
- TREBA DODATI OTPORNIK
- (near D13) ZA MJERENJE STRUJE
- TRANSFORAMTOR IDE VAN PLOČE
- OSTAVLJENI SAMO PRIKLJUCI NA PCB
- Ostavljeno da se mogu koristiti
- isti signali sa gornjeg kola
- (in symbol BUK7Y9R9-80EX) 1, 2, 3

### Library data of the parts
C23 C27 = CL31B225KBHVPNE: as C14 on sheet Sender_Power; Width: 0.063inch; Case/Package: 1206; Tolerance: 10%; Mount: Surface Mount; Capacitance: 2.2uF; Ratings: AEC-Q200; Thickness: 0.071inch; Voltage Rating: 50V; Features: Soft Termination; Case Code (Metric): 3216; Length: 0.126inch; Packaging: Tape and Reel; Max Operating Temperature: 125°C; Min Operating Temperature: -55°C; Case Code (Imperial): 1206; Dielectric: X7R
C24 C28 = GRM216R61E105KA12D: 1µF ±10% 25V Ceramic Capacitor X5R 0805 (2012 Metric); Manufacturer: Murata; Part Number: GRM216R61E105KA12D
C25 C26 C29 C30 = C0201C101J3GACTU: 100pF ±5% 25V Ceramic Capacitor C0G, NP0 0201 (0603 Metric); Manufacturer: KEMET; Capacitance: 100pF; Case Code (Imperial): 0201; Case Code (Metric): 0603; Case/Package: 0201; Category: Ceramic Capacitors; Construction: Flat; Depth: 0.3mm; Dielectric: C0G; Height: 0.3mm; Length: 0.6mm; Manufacturer Part Number: C0201C101J3GACTU; Max Operating Temperature: 125°C; Min Operating Temperature: -55°C; Mount: Surface Mount; Package Quantity: 1; Packaging: Tape and Reel; Radiation Hardening: No; RoHS Compliant: Yes; Series: C; Thickness: 0.013inch; Tolerance: 5%; Voltage: 25V; Voltage Rating: 25V; Width: 0.3mm; ComponentLink1URL: https://datasheet.ciiva.com/25795/cl31b106kahnnne-25795260.pdf?src-supplier=Digi-Key; ComponentLink1Description: https://datasheet.ciiva.com/25795/cl31b106kahnnne-25795260.pdf?src-supplier=Digi-Key; Contact Plating: Tin,Matte; REACH SVHC: No SVHC; Termination: SMD/SMT; Voltage Rating (DC): 25V; Weight: 6E-06oz
C31 C32 = C-0805: Manufacturer 1: Yageo; Manufacturer Part Number 1: CC1206KKX7RBBB332; Tolerance: ±10%; Voltage - Rated: 500V; Temperature Coefficient: X7R; Notification: Current market demand for these product types have resulted in fluctuating and extending lead times. Lead times may differ.; Description 1: CAP CER 3300PF 500V X7R 1206; Category 1: Capacitors; Packaging: Cut Tape (CT); Part Status: Active; Operating Temperature: -55°C ~ 125°C; Features: -; Ratings: -; Applications: General Purpose; Failure Rate: -; Mounting Type: Surface Mount, MLCC; Package / Case: 1206 (3216 Metric); Size / Dimension: 0.126" L x 0.063" W (3.20mm x 1.60mm); Height - Seated (Max): -; Thickness (Max): 0.057" (1.45mm); Lead Spacing: -; Lead Style: -; ComponentLink1URL: http://www.yageo.com/documents/recent/UPY-NP0X7R_MV_100-to-630V_21.pdf; ComponentLink1Description: http://www.yageo.com/documents/recent/UPY-NP0X7R_MV_100-to-630V_21.pdf; Supplier 1: Digi-Key; Supplier Part Number 1: 311-1506-1-ND; RoHS 1: RoHS Compliant; Stock 1: 4928; Pricing 1: 1=0.31, 10=0.214, 100=0.1085, 500=0.07424, 1000=0.06568 (USD)
D5 D11 = MBR2H200SFT1G: DIODE SCHOTTKY 200V 2A SOD123FL; Manufacturer: ON Semiconductor; Peak Reverse Current: 200uA; Max Surge Forward Current: 30A; Max Junction Temp: +150°C; Standoff Height: 0mm; Device Class L1: Discrete Semiconductors; Package: 498; Temperature Range High: +150°C; Height: 0.98mm; Temperature: -55°C to +150°C; Forward Current: 2A; Octopart: https://octopart.com/mbr2h200sft1g-on+semiconductor-51167333; Reverse Voltage: 200V; Max Repetitive Reverse Voltage: 200V; RoHS: TRUE; Lead Free: Yes; Footprint Url: https://www.onsemi.com/pub/Collateral/498-01.PDF; ComponentLink2Description: Datasheet; Category: Diode; Manufacturer Part Number: MBR2H200SFT1G; Digikey Description: DIODE SCHOTTKY 200V 2A SOD123FL; Device Class L3: Schottky Diodes; Temperature Range Low: -55°C; ComponentLink2URL: https://www.onsemi.com/pub/Collateral/MBR2H200SF-D.PDF; Automotive: No; Device Class L2: Diodes
D6-D10 D12 = B0530W-7-F: DIODE SCHOTTKY 30V 500MA SOD123; Manufacturer: Diodes Inc.; Max Surge Forward Current: 5.5A; Forward Current: 0.5A; Max Junction Temp: +125°C; Standoff Height: 0mm; Capacitance: 170pF; Value: 170pF; Peak Reverse Current: 130uA; Footprint Url: https://www.diodes.com/assets/Package-Files/SOD123.pdf; Device Class L1: Discrete Semiconductors; ComponentLink2Description: Datasheet; Mouser Description: Schottky Diodes & Rectifiers 30V 410mW; Device Class L3: Schottky Diodes; Package: SOD123; Temperature: -65°C to +125°C; Temperature Range Low: -65°C; Lead Free: Yes; Digikey Description: DIODE SCHOTTKY 30V 500MA SOD123; Ipc Land Pattern Name: SOD365155X123-2; Automotive: No; Octopart: https://octopart.com/b0530w-7-f-diodes+inc.-325721; Device Class L2: Diodes; ComponentLink2URL: https://www.diodes.com/assets/Datasheets/ds30139.pdf; RoHS: TRUE; Height: 1.45mm; Max Repetitive Reverse Voltage: 30V; Category: Diode; Temperature Range High: +125°C; Manufacturer Part Number: B0530W-7-F; Reverse Voltage: 30V
D13-D16 = ES1x: Diode; Manufacturer: Fairchild/ON Semiconductor; Diode Type: Standard; Voltage - DC Reverse (Vr) (Max): 200V; Current - Average Rectified (Io): 1A; Voltage - Forward (Vf) (Max) @ If: 920mV @ 1A; Speed: Fast Recovery =< 500ns, > 200mA (Io); Reverse Recovery Time (trr): 15ns; Current - Reverse Leakage @ Vr: 5μA @ 200V; Capacitance @ Vr, F: 7pF @ 4V, 1MHz; Supplier 1: Digi-Key; Supplier Part Number 1: ES1DFSTR-ND; Manufacturer Part Number: ES1D; RoHS: RoHS Compliant; Category: Discrete Semiconductor Products; Stock 1: 135000; Pricing 1: 7500=0.0567, 15000=0.0504, 37500=0.04725, 52500=0.0419, 187500=0.04032 (USD); Packaging: Tape & Reel (TR); Part Status: Active; Mounting Type: Surface Mount; Package / Case: DO-214AC, SMA; Supplier Device Package: SMA (DO-214AC); Operating Temperature - Junction: -55°C ~ 150°C; ComponentLink1URL: https://www.fairchildsemi.com/datasheets/ES/ES1A.pdf; ComponentLink1Description: https://www.fairchildsemi.com/datasheets/ES/ES1A.pdf
Q1-Q4 = BUK7Y9R9-80EX: N-Channel 80V 89A (Tc) 195W (Tc) Surface Mount LFPAK56, Power-SO8; Manufacturer: Nexperia; Category: MOSFETs; Manufacturer Part Number: BUK7Y9R9-80EX; RoHS Compliant: No; ComponentLink1URL: https://assets.nexperia.com/documents/data-sheet/BUK7Y9R9-80E.pdf?src-supplier=Digi-Key; ComponentLink1Description: https://assets.nexperia.com/documents/data-sheet/BUK7Y9R9-80E.pdf?src-supplier=Digi-Key
R17 R18 R24 R25 = CRCW08058R20JNEA: 8.2 Ohms ±5% 0.125W, 1/8W Chip Resistor 0805 (2012 Metric) Automotive AEC-Q200 Thick Film; Manufacturer: Vishay Dale; Max Power Dissipation: 125mW; Temperature Coefficient: 200ppm/°C; Voltage Rating: 150V; Case Code (Imperial): 0805; Case Code (Metric): 2012; Case/Package: 0805; Category: Chip SMD Resistors; Construction: Rectangular; Contact Plating: Tin; Depth: 1.25mm; Features: Automotive AEC-Q200; Height: 0.02inch; Lead Free: Lead Free; Length: 2mm; Manufacturer Part Number: CRCW08058R20JNEA; Max Operating Temperature: 155°C; Military Standard: Not; Min Operating Temperature: -55°C; Mount: Surface Mount; Number of Pins: 2; Number of Terminations: 2; Package Quantity: 1; Packaging: Tape and Reel; Power Rating: 125mW; Radiation Hardening: No; REACH SVHC: Unknown; Resistance: 8.2R; Resistance Tolerance: 5%; Resistor Type: Thick Film; RoHS Compliant: Yes; Series: CRCW; Size Code: 0805; Tolerance: 5%; Voltage Rating (DC): 150V; Weight: 0.000194oz; Width: 1.25mm; ComponentLink1URL: https://datasheet.ciiva.com/2512/dcrcwe3-2512297.pdf?src-supplier=Digi-Key; ComponentLink1Description: https://datasheet.ciiva.com/2512/dcrcwe3-2512297.pdf?src-supplier=Digi-Key
R19 R28 = CRCW12062R00FKEA: 2 Ohms ±1% 0.25W, 1/4W Chip Resistor 1206 (3216 Metric) Automotive AEC-Q200 Thick Film; Manufacturer: Vishay Dale; Max Power Dissipation: 250mW; Temperature Coefficient: 100ppm/°C; Voltage Rating: 200V; Case Code (Imperial): 1206; Case Code (Metric): 3216; Case/Package: 1206; Category: Chip SMD Resistors; Construction: Rectangular; Contact Plating: Tin; Depth: 1.6mm; Features: Automotive AEC-Q200; Height: 0.024inch; Lead Free: Lead Free; Length: 3.2mm; Manufacturer Part Number: CRCW12062R00FKEA; Max Operating Temperature: 155°C; Military Standard: Not; Min Operating Temperature: -55°C; Number of Pins: 2; Number of Terminations: 2; Package Quantity: 10; Packaging: Tape and Reel; Power Rating: 250mW; Radiation Hardening: No; REACH SVHC: Unknown; Resistance: 2R; Resistance Tolerance: 1%; Resistor Type: Thick Film; RoHS Compliant: Yes; Series: CRCW; Termination: SMD/SMT; Tolerance: 1%; Voltage Rating (DC): 200V; Weight: 0.000353oz; Width: 1.6mm; ComponentLink1URL: https://datasheet.ciiva.com/2469/dcrcwe3-2469237.pdf?src-supplier=Digi-Key; ComponentLink1Description: https://datasheet.ciiva.com/2469/dcrcwe3-2469237.pdf?src-supplier=Digi-Key
R20 R21 R26 R27 = RR0816P-103-D: 10 kOhms ±0.5% 0.063W, 1/16W Chip Resistor 0603 (1608 Metric)  Thin Film; Manufacturer: Susumu; Max Power Dissipation: 63mW; Resistance: 10kR; Temperature Coefficient: 25ppm/°C; Voltage Rating: 75V; Width: 0.8mm; Case Code (Imperial): 0603; Case Code (Metric): 1608; Case/Package: 0603; Category: Chip SMD Resistors; Depth: 0.8mm; Height: 0.4mm; Lead Free: Lead Free; Length: 1.6mm; Manufacturer Part Number: RR0816P-103-D; Max Operating Temperature: 125°C; Min Operating Temperature: -55°C; Number of Pins: 2; Number of Terminations: 2; Package Quantity: 1; Packaging: Tape and Reel; Power Rating: 63mW; REACH SVHC: Unknown; Resistance Tolerance: 0.5%; Resistor Type: Thin Film; RoHS Compliant: Yes; Series: RR; Size Code: 0603; Technology: THIN FILM; Termination: SMD/SMT; Tolerance: 0.5%; Voltage Rating (DC): 75V; Weight: 7.1E-05oz
R22 R23 R30 R31 = RR0816P-102-D: 1 kOhms ±0.5% 0.063W, 1/16W Chip Resistor 0603 (1608 Metric)  Thin Film; Manufacturer: Susumu; Max Power Dissipation: 63mW; Resistance: 1kR; Temperature Coefficient: 25ppm/°C; Voltage Rating: 75V; Width: 0.031inch; Case Code (Imperial): 0603; Case Code (Metric): 1608; Case/Package: 0603; Category: Chip SMD Resistors; Depth: 0.8mm; Height: 0.4mm; Lead Free: Lead Free; Length: 1.6mm; Manufacturer Part Number: RR0816P-102-D; Max Operating Temperature: 125°C; Min Operating Temperature: -55°C; Number of Pins: 2; Number of Terminations: 2; Package Quantity: 1; Packaging: Tape and Reel; Power Rating: 63mW; REACH SVHC: Unknown; Resistance Tolerance: 0.5%; Resistor Type: Thin Film; RoHS Compliant: Yes; Series: RR; Size Code: 0603; Technology: THIN FILM; Termination: SMD/SMT; Tolerance: 0.5%; Voltage Rating (DC): 75V; ComponentLink1URL: https://datasheet.ciiva.com/2487/rr-data-sheet-2487025.pdf?src-supplier=Digi-Key; ComponentLink1Description: https://datasheet.ciiva.com/2487/rr-data-sheet-2487025.pdf?src-supplier=Digi-Key
R29 R33 = RC0805JR-070RL: as R15 on sheet Sender_Power
R32 = CRCW0805xxxxJN Default: as R1 on sheet Sender_Power
U4 U5 = UCC27211D: Half-Bridge Gate Driver IC Non-Inverting 8-SOIC; Manufacturer: Texas Instruments; Fall Time: 400ns; Max Output Current: 4A; Max Supply Current: 4.3mA; Max Supply Voltage: 17V; Min Supply Voltage: 8V; Number of Channels: 2; Operating Supply Voltage: 12V; Propagation Delay: 40ns; Rise Time: 600ns; Case/Package: SOIC; Category: Gate Drivers; Height: 1.5mm; Lead Free: Lead Free; Length: 5mm; Manufacturer Part Number: UCC27211D; Max Operating Temperature: 140°C; Min Operating Temperature: -40°C; Mount: Surface Mount; Nominal Supply Current: 4A; Number of Drivers: 2; Number of Outputs: 2; Number of Pins: 8; Output Current: 4A; Package Quantity: 75; Packaging: Rail/Tube; Radiation Hardening: No; REACH SVHC: No SVHC; RoHS Compliant: Yes; Series: -; Supply Current: 4A; Turn-On Delay Time: 40ns; Width: 4mm; ComponentLink1URL: https://datasheet.ciiva.com/1951/ucc27210-1951181.pdf?src-supplier=Digi-Key; ComponentLink1Description: https://datasheet.ciiva.com/1951/ucc27210-1951181.pdf?src-supplier=Digi-Key